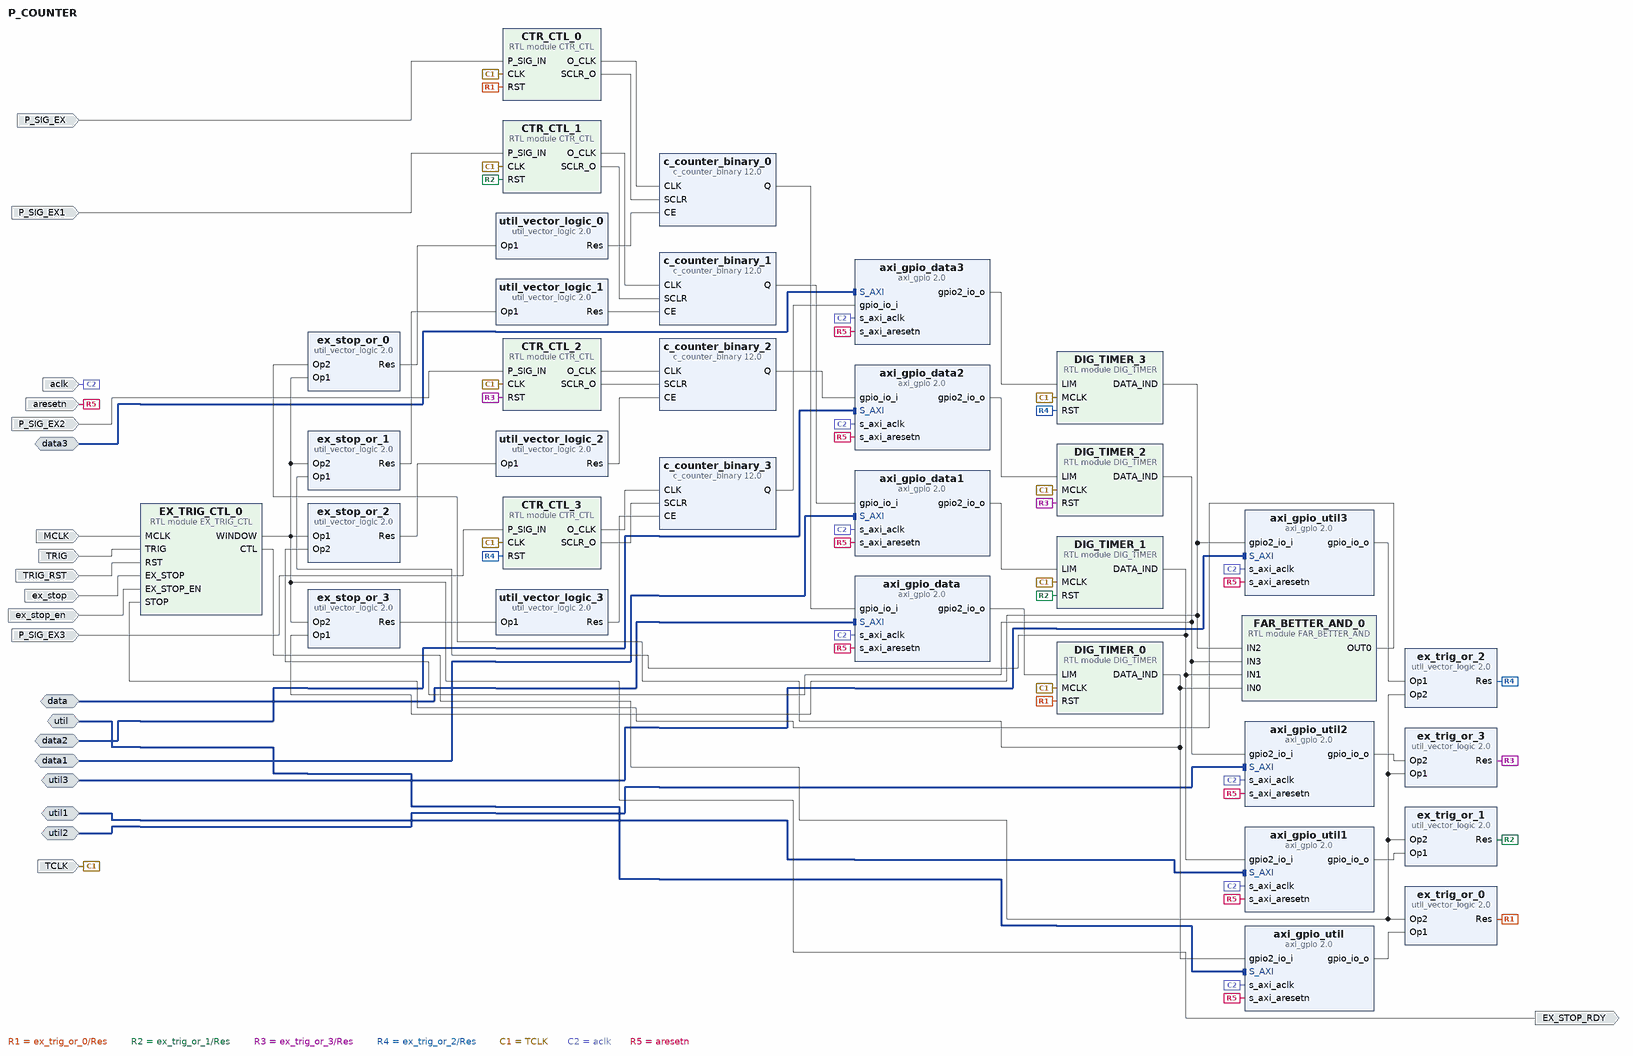
[diagram p0: block diagram of the top level]
# Vivado block design P_COUNTER, xc7z020clg400-1, Vivado 2019.1
create_bd_design P_COUNTER

create_bd_intf_port -mode Slave -vlnv xilinx.com:interface:aximm_tlm:1.0 data
create_bd_intf_port -mode Slave -vlnv xilinx.com:interface:aximm_tlm:1.0 data1
create_bd_intf_port -mode Slave -vlnv xilinx.com:interface:aximm_tlm:1.0 data2
create_bd_intf_port -mode Slave -vlnv xilinx.com:interface:aximm_tlm:1.0 data3
create_bd_intf_port -mode Slave -vlnv xilinx.com:interface:aximm_tlm:1.0 util
create_bd_intf_port -mode Slave -vlnv xilinx.com:interface:aximm_tlm:1.0 util1
create_bd_intf_port -mode Slave -vlnv xilinx.com:interface:aximm_tlm:1.0 util2
create_bd_intf_port -mode Slave -vlnv xilinx.com:interface:aximm_tlm:1.0 util3
create_bd_port -dir I P_SIG_EX
create_bd_port -dir I P_SIG_EX1
create_bd_port -dir I P_SIG_EX2
create_bd_port -dir I P_SIG_EX3
create_bd_port -dir I TCLK
create_bd_port -dir I aclk
create_bd_port -dir I aresetn
create_bd_port -dir I MCLK
create_bd_port -dir I TRIG
create_bd_port -dir I TRIG_RST
create_bd_port -dir I ex_stop
create_bd_port -dir I ex_stop_en
create_bd_port -dir O EX_STOP_RDY

create_bd_cell -type module -reference CTR_CTL CTR_CTL_0
create_bd_cell -type module -reference CTR_CTL CTR_CTL_1
create_bd_cell -type module -reference CTR_CTL CTR_CTL_2
create_bd_cell -type module -reference CTR_CTL CTR_CTL_3
create_bd_cell -type ip -vlnv xilinx.com:ip:axi_gpio:2.0 axi_gpio_data
set_property -dict {CONFIG.C_ALL_INPUTS 1 CONFIG.C_ALL_OUTPUTS_2 1 CONFIG.C_IS_DUAL 1} [get_bd_cells axi_gpio_data]
create_bd_cell -type ip -vlnv xilinx.com:ip:axi_gpio:2.0 axi_gpio_data1
set_property -dict {CONFIG.C_ALL_INPUTS 1 CONFIG.C_ALL_OUTPUTS_2 1 CONFIG.C_IS_DUAL 1} [get_bd_cells axi_gpio_data1]
create_bd_cell -type ip -vlnv xilinx.com:ip:axi_gpio:2.0 axi_gpio_data2
set_property -dict {CONFIG.C_ALL_INPUTS 1 CONFIG.C_ALL_OUTPUTS_2 1 CONFIG.C_IS_DUAL 1} [get_bd_cells axi_gpio_data2]
create_bd_cell -type ip -vlnv xilinx.com:ip:axi_gpio:2.0 axi_gpio_data3
set_property -dict {CONFIG.C_ALL_INPUTS 1 CONFIG.C_ALL_OUTPUTS_2 1 CONFIG.C_IS_DUAL 1} [get_bd_cells axi_gpio_data3]
create_bd_cell -type ip -vlnv xilinx.com:ip:axi_gpio:2.0 axi_gpio_util
set_property -dict [list \
  CONFIG.C_ALL_INPUTS 0 \
  CONFIG.C_ALL_INPUTS_2 1 \
  CONFIG.C_ALL_OUTPUTS 1 \
  CONFIG.C_GPIO2_WIDTH 1 \
  CONFIG.C_GPIO_WIDTH 1 \
  CONFIG.C_IS_DUAL 1 \
] [get_bd_cells axi_gpio_util]
create_bd_cell -type ip -vlnv xilinx.com:ip:axi_gpio:2.0 axi_gpio_util1
set_property -dict [list \
  CONFIG.C_ALL_INPUTS 0 \
  CONFIG.C_ALL_INPUTS_2 1 \
  CONFIG.C_ALL_OUTPUTS 1 \
  CONFIG.C_GPIO2_WIDTH 1 \
  CONFIG.C_GPIO_WIDTH 1 \
  CONFIG.C_IS_DUAL 1 \
] [get_bd_cells axi_gpio_util1]
create_bd_cell -type ip -vlnv xilinx.com:ip:axi_gpio:2.0 axi_gpio_util2
set_property -dict [list \
  CONFIG.C_ALL_INPUTS 0 \
  CONFIG.C_ALL_INPUTS_2 1 \
  CONFIG.C_ALL_OUTPUTS 1 \
  CONFIG.C_GPIO2_WIDTH 1 \
  CONFIG.C_GPIO_WIDTH 1 \
  CONFIG.C_IS_DUAL 1 \
] [get_bd_cells axi_gpio_util2]
create_bd_cell -type ip -vlnv xilinx.com:ip:axi_gpio:2.0 axi_gpio_util3
set_property -dict [list \
  CONFIG.C_ALL_INPUTS 0 \
  CONFIG.C_ALL_INPUTS_2 1 \
  CONFIG.C_ALL_OUTPUTS 1 \
  CONFIG.C_GPIO2_WIDTH 1 \
  CONFIG.C_GPIO_WIDTH 1 \
  CONFIG.C_IS_DUAL 1 \
] [get_bd_cells axi_gpio_util3]
create_bd_cell -type ip -vlnv xilinx.com:ip:c_counter_binary:12.0 c_counter_binary_0
set_property -dict [list \
  CONFIG.CE true \
  CONFIG.Implementation DSP48 \
  CONFIG.Output_Width 32 \
  CONFIG.SCLR true \
] [get_bd_cells c_counter_binary_0]
create_bd_cell -type ip -vlnv xilinx.com:ip:c_counter_binary:12.0 c_counter_binary_1
set_property -dict [list \
  CONFIG.CE true \
  CONFIG.Implementation DSP48 \
  CONFIG.Output_Width 32 \
  CONFIG.SCLR true \
] [get_bd_cells c_counter_binary_1]
create_bd_cell -type ip -vlnv xilinx.com:ip:c_counter_binary:12.0 c_counter_binary_2
set_property -dict [list \
  CONFIG.CE true \
  CONFIG.Implementation DSP48 \
  CONFIG.Output_Width 32 \
  CONFIG.SCLR true \
] [get_bd_cells c_counter_binary_2]
create_bd_cell -type ip -vlnv xilinx.com:ip:c_counter_binary:12.0 c_counter_binary_3
set_property -dict [list \
  CONFIG.CE true \
  CONFIG.Implementation DSP48 \
  CONFIG.Output_Width 32 \
  CONFIG.SCLR true \
] [get_bd_cells c_counter_binary_3]
create_bd_cell -type ip -vlnv xilinx.com:ip:util_vector_logic:2.0 util_vector_logic_0
set_property -dict {CONFIG.C_OPERATION not CONFIG.C_SIZE 1} [get_bd_cells util_vector_logic_0]
create_bd_cell -type ip -vlnv xilinx.com:ip:util_vector_logic:2.0 util_vector_logic_1
set_property -dict {CONFIG.C_OPERATION not CONFIG.C_SIZE 1} [get_bd_cells util_vector_logic_1]
create_bd_cell -type ip -vlnv xilinx.com:ip:util_vector_logic:2.0 util_vector_logic_2
set_property -dict {CONFIG.C_OPERATION not CONFIG.C_SIZE 1} [get_bd_cells util_vector_logic_2]
create_bd_cell -type ip -vlnv xilinx.com:ip:util_vector_logic:2.0 util_vector_logic_3
set_property -dict {CONFIG.C_OPERATION not CONFIG.C_SIZE 1} [get_bd_cells util_vector_logic_3]
create_bd_cell -type module -reference DIG_TIMER DIG_TIMER_0
create_bd_cell -type module -reference DIG_TIMER DIG_TIMER_1
create_bd_cell -type module -reference DIG_TIMER DIG_TIMER_2
create_bd_cell -type module -reference DIG_TIMER DIG_TIMER_3
create_bd_cell -type ip -vlnv xilinx.com:ip:util_vector_logic:2.0 ex_trig_or_0
set_property -dict {CONFIG.C_OPERATION or CONFIG.C_SIZE 1} [get_bd_cells ex_trig_or_0]
create_bd_cell -type ip -vlnv xilinx.com:ip:util_vector_logic:2.0 ex_trig_or_1
set_property -dict {CONFIG.C_OPERATION or CONFIG.C_SIZE 1} [get_bd_cells ex_trig_or_1]
create_bd_cell -type ip -vlnv xilinx.com:ip:util_vector_logic:2.0 ex_trig_or_2
set_property -dict {CONFIG.C_OPERATION or CONFIG.C_SIZE 1} [get_bd_cells ex_trig_or_2]
create_bd_cell -type ip -vlnv xilinx.com:ip:util_vector_logic:2.0 ex_trig_or_3
set_property -dict {CONFIG.C_OPERATION or CONFIG.C_SIZE 1} [get_bd_cells ex_trig_or_3]
create_bd_cell -type ip -vlnv xilinx.com:ip:util_vector_logic:2.0 ex_stop_or_0
set_property -dict {CONFIG.C_OPERATION or CONFIG.C_SIZE 1} [get_bd_cells ex_stop_or_0]
create_bd_cell -type module -reference EX_TRIG_CTL EX_TRIG_CTL_0
create_bd_cell -type ip -vlnv xilinx.com:ip:util_vector_logic:2.0 ex_stop_or_1
set_property -dict {CONFIG.C_OPERATION or CONFIG.C_SIZE 1} [get_bd_cells ex_stop_or_1]
create_bd_cell -type ip -vlnv xilinx.com:ip:util_vector_logic:2.0 ex_stop_or_2
set_property -dict {CONFIG.C_OPERATION or CONFIG.C_SIZE 1} [get_bd_cells ex_stop_or_2]
create_bd_cell -type ip -vlnv xilinx.com:ip:util_vector_logic:2.0 ex_stop_or_3
set_property -dict {CONFIG.C_OPERATION or CONFIG.C_SIZE 1} [get_bd_cells ex_stop_or_3]
create_bd_cell -type module -reference FAR_BETTER_AND FAR_BETTER_AND_0

# ---- connections ----

connect_bd_intf_net -intf_net S_AXI_0_4 [get_bd_intf_ports data3] [get_bd_intf_pins axi_gpio_data3/S_AXI]
connect_bd_intf_net -intf_net s_axi_1_1 [get_bd_intf_ports util] [get_bd_intf_pins axi_gpio_util/S_AXI]
connect_bd_intf_net -intf_net S_AXI_0_1 [get_bd_intf_ports data] [get_bd_intf_pins axi_gpio_data/S_AXI]
connect_bd_intf_net -intf_net S_AXI_0_3 [get_bd_intf_ports data2] [get_bd_intf_pins axi_gpio_data2/S_AXI]
connect_bd_intf_net -intf_net s_axi_1_4 [get_bd_intf_ports util3] [get_bd_intf_pins axi_gpio_util3/S_AXI]
connect_bd_intf_net -intf_net s_axi_1_2 [get_bd_intf_ports util1] [get_bd_intf_pins axi_gpio_util1/S_AXI]
connect_bd_intf_net -intf_net s_axi_1_3 [get_bd_intf_ports util2] [get_bd_intf_pins axi_gpio_util2/S_AXI]
connect_bd_intf_net -intf_net S_AXI_0_2 [get_bd_intf_ports data1] [get_bd_intf_pins axi_gpio_data1/S_AXI]
connect_bd_net [get_bd_pins CTR_CTL_0/O_CLK] [get_bd_pins c_counter_binary_0/CLK]
connect_bd_net -net CTR_CTL_0_O_CLK1 [get_bd_pins CTR_CTL_1/O_CLK] [get_bd_pins c_counter_binary_1/CLK]
connect_bd_net -net CTR_CTL_0_O_CLK2 [get_bd_pins CTR_CTL_2/O_CLK] [get_bd_pins c_counter_binary_2/CLK]
connect_bd_net -net CTR_CTL_0_O_CLK3 [get_bd_pins CTR_CTL_3/O_CLK] [get_bd_pins c_counter_binary_3/CLK]
connect_bd_net [get_bd_pins CTR_CTL_0/SCLR_O] [get_bd_pins c_counter_binary_0/SCLR]
connect_bd_net -net CTR_CTL_0_SCLR_O1 [get_bd_pins CTR_CTL_1/SCLR_O] [get_bd_pins c_counter_binary_1/SCLR]
connect_bd_net -net CTR_CTL_0_SCLR_O2 [get_bd_pins CTR_CTL_2/SCLR_O] [get_bd_pins c_counter_binary_2/SCLR]
connect_bd_net -net CTR_CTL_0_SCLR_O3 [get_bd_pins CTR_CTL_3/SCLR_O] [get_bd_pins c_counter_binary_3/SCLR]
connect_bd_net [get_bd_pins DIG_TIMER_0/DATA_IND] \
  [get_bd_pins axi_gpio_util/gpio2_io_i] [get_bd_pins ex_stop_or_0/Op2] [get_bd_pins FAR_BETTER_AND_0/IN0]
connect_bd_net -net DIG_TIMER_0_DATA_IND1 [get_bd_pins DIG_TIMER_1/DATA_IND] \
  [get_bd_pins axi_gpio_util1/gpio2_io_i] [get_bd_pins ex_stop_or_1/Op1] [get_bd_pins FAR_BETTER_AND_0/IN1]
connect_bd_net -net DIG_TIMER_0_DATA_IND2 [get_bd_pins DIG_TIMER_2/DATA_IND] \
  [get_bd_pins axi_gpio_util2/gpio2_io_i] [get_bd_pins ex_stop_or_2/Op2] [get_bd_pins FAR_BETTER_AND_0/IN3]
connect_bd_net -net DIG_TIMER_0_DATA_IND3 [get_bd_pins DIG_TIMER_3/DATA_IND] \
  [get_bd_pins axi_gpio_util3/gpio2_io_i] [get_bd_pins ex_stop_or_3/Op1] [get_bd_pins FAR_BETTER_AND_0/IN2]
connect_bd_net [get_bd_pins ex_trig_or_0/Res] [get_bd_pins CTR_CTL_0/RST] [get_bd_pins DIG_TIMER_0/RST]
connect_bd_net [get_bd_pins ex_trig_or_1/Res] [get_bd_pins CTR_CTL_1/RST] [get_bd_pins DIG_TIMER_1/RST]
connect_bd_net [get_bd_pins ex_trig_or_3/Res] [get_bd_pins CTR_CTL_2/RST] [get_bd_pins DIG_TIMER_2/RST]
connect_bd_net [get_bd_pins ex_trig_or_2/Res] [get_bd_pins CTR_CTL_3/RST] [get_bd_pins DIG_TIMER_3/RST]
connect_bd_net [get_bd_ports P_SIG_EX] [get_bd_pins CTR_CTL_0/P_SIG_IN]
connect_bd_net [get_bd_ports P_SIG_EX1] [get_bd_pins CTR_CTL_1/P_SIG_IN]
connect_bd_net [get_bd_ports P_SIG_EX2] [get_bd_pins CTR_CTL_2/P_SIG_IN]
connect_bd_net [get_bd_ports P_SIG_EX3] [get_bd_pins CTR_CTL_3/P_SIG_IN]
connect_bd_net [get_bd_ports TCLK] \
  [get_bd_pins CTR_CTL_0/CLK] [get_bd_pins CTR_CTL_1/CLK] [get_bd_pins CTR_CTL_3/CLK] [get_bd_pins CTR_CTL_2/CLK] \
  [get_bd_pins DIG_TIMER_1/MCLK] [get_bd_pins DIG_TIMER_0/MCLK] [get_bd_pins DIG_TIMER_2/MCLK] [get_bd_pins DIG_TIMER_3/MCLK]
connect_bd_net [get_bd_pins c_counter_binary_0/Q] [get_bd_pins axi_gpio_data/gpio_io_i]
connect_bd_net -net c_counter_binary_0_Q1 [get_bd_pins c_counter_binary_1/Q] [get_bd_pins axi_gpio_data1/gpio_io_i]
connect_bd_net -net c_counter_binary_0_Q2 [get_bd_pins c_counter_binary_2/Q] [get_bd_pins axi_gpio_data2/gpio_io_i]
connect_bd_net -net c_counter_binary_0_Q3 [get_bd_pins c_counter_binary_3/Q] [get_bd_pins axi_gpio_data3/gpio_io_i]
connect_bd_net -net s_axi_clk_1 [get_bd_ports aclk] \
  [get_bd_pins axi_gpio_data/s_axi_aclk] [get_bd_pins axi_gpio_util/s_axi_aclk] [get_bd_pins axi_gpio_data3/s_axi_aclk] \
  [get_bd_pins axi_gpio_util3/s_axi_aclk] [get_bd_pins axi_gpio_data2/s_axi_aclk] [get_bd_pins axi_gpio_util2/s_axi_aclk] \
  [get_bd_pins axi_gpio_data1/s_axi_aclk] [get_bd_pins axi_gpio_util1/s_axi_aclk]
connect_bd_net -net s_axi_rst_1 [get_bd_ports aresetn] \
  [get_bd_pins axi_gpio_data/s_axi_aresetn] [get_bd_pins axi_gpio_util/s_axi_aresetn] \
  [get_bd_pins axi_gpio_data3/s_axi_aresetn] [get_bd_pins axi_gpio_util3/s_axi_aresetn] \
  [get_bd_pins axi_gpio_data2/s_axi_aresetn] [get_bd_pins axi_gpio_util2/s_axi_aresetn] \
  [get_bd_pins axi_gpio_data1/s_axi_aresetn] [get_bd_pins axi_gpio_util1/s_axi_aresetn]
connect_bd_net [get_bd_pins util_vector_logic_0/Res] [get_bd_pins c_counter_binary_0/CE]
connect_bd_net -net util_vector_logic_0_Res1 [get_bd_pins util_vector_logic_1/Res] [get_bd_pins c_counter_binary_1/CE]
connect_bd_net -net util_vector_logic_0_Res2 [get_bd_pins util_vector_logic_2/Res] [get_bd_pins c_counter_binary_2/CE]
connect_bd_net -net util_vector_logic_0_Res3 [get_bd_pins util_vector_logic_3/Res] [get_bd_pins c_counter_binary_3/CE]
connect_bd_net [get_bd_pins axi_gpio_data/gpio2_io_o] [get_bd_pins DIG_TIMER_0/LIM]
connect_bd_net [get_bd_pins axi_gpio_data1/gpio2_io_o] [get_bd_pins DIG_TIMER_1/LIM]
connect_bd_net [get_bd_pins axi_gpio_data2/gpio2_io_o] [get_bd_pins DIG_TIMER_2/LIM]
connect_bd_net [get_bd_pins axi_gpio_data3/gpio2_io_o] [get_bd_pins DIG_TIMER_3/LIM]
connect_bd_net [get_bd_pins axi_gpio_util/gpio_io_o] [get_bd_pins ex_trig_or_0/Op1]
connect_bd_net [get_bd_pins EX_TRIG_CTL_0/CTL] \
  [get_bd_pins ex_trig_or_0/Op2] [get_bd_pins ex_trig_or_1/Op2] [get_bd_pins ex_trig_or_2/Op2] [get_bd_pins ex_trig_or_3/Op1]
connect_bd_net [get_bd_pins axi_gpio_util1/gpio_io_o] [get_bd_pins ex_trig_or_1/Op1]
connect_bd_net [get_bd_pins axi_gpio_util3/gpio_io_o] [get_bd_pins ex_trig_or_2/Op1]
connect_bd_net [get_bd_pins axi_gpio_util2/gpio_io_o] [get_bd_pins ex_trig_or_3/Op2]
connect_bd_net [get_bd_ports MCLK] [get_bd_pins EX_TRIG_CTL_0/MCLK]
connect_bd_net [get_bd_pins FAR_BETTER_AND_0/OUT0] [get_bd_pins EX_TRIG_CTL_0/STOP]
connect_bd_net [get_bd_ports TRIG] [get_bd_pins EX_TRIG_CTL_0/TRIG]
connect_bd_net [get_bd_ports TRIG_RST] [get_bd_pins EX_TRIG_CTL_0/RST]
connect_bd_net -net util_vector_logic_4_Res [get_bd_pins ex_stop_or_0/Res] [get_bd_pins util_vector_logic_0/Op1]
connect_bd_net [get_bd_pins EX_TRIG_CTL_0/WINDOW] \
  [get_bd_pins ex_stop_or_0/Op1] [get_bd_pins ex_stop_or_1/Op2] [get_bd_pins ex_stop_or_2/Op1] [get_bd_pins ex_stop_or_3/Op2] \
  [get_bd_ports EX_STOP_RDY]
connect_bd_net [get_bd_pins ex_stop_or_1/Res] [get_bd_pins util_vector_logic_1/Op1]
connect_bd_net [get_bd_pins ex_stop_or_2/Res] [get_bd_pins util_vector_logic_2/Op1]
connect_bd_net [get_bd_pins ex_stop_or_3/Res] [get_bd_pins util_vector_logic_3/Op1]
connect_bd_net [get_bd_ports ex_stop] [get_bd_pins EX_TRIG_CTL_0/EX_STOP]
connect_bd_net [get_bd_ports ex_stop_en] [get_bd_pins EX_TRIG_CTL_0/EX_STOP_EN]

validate_bd_design
save_bd_design
